# Altium schematic sheet Sheet1.SchDoc
size A4; SheetNumber: 1; SheetTotal: 1
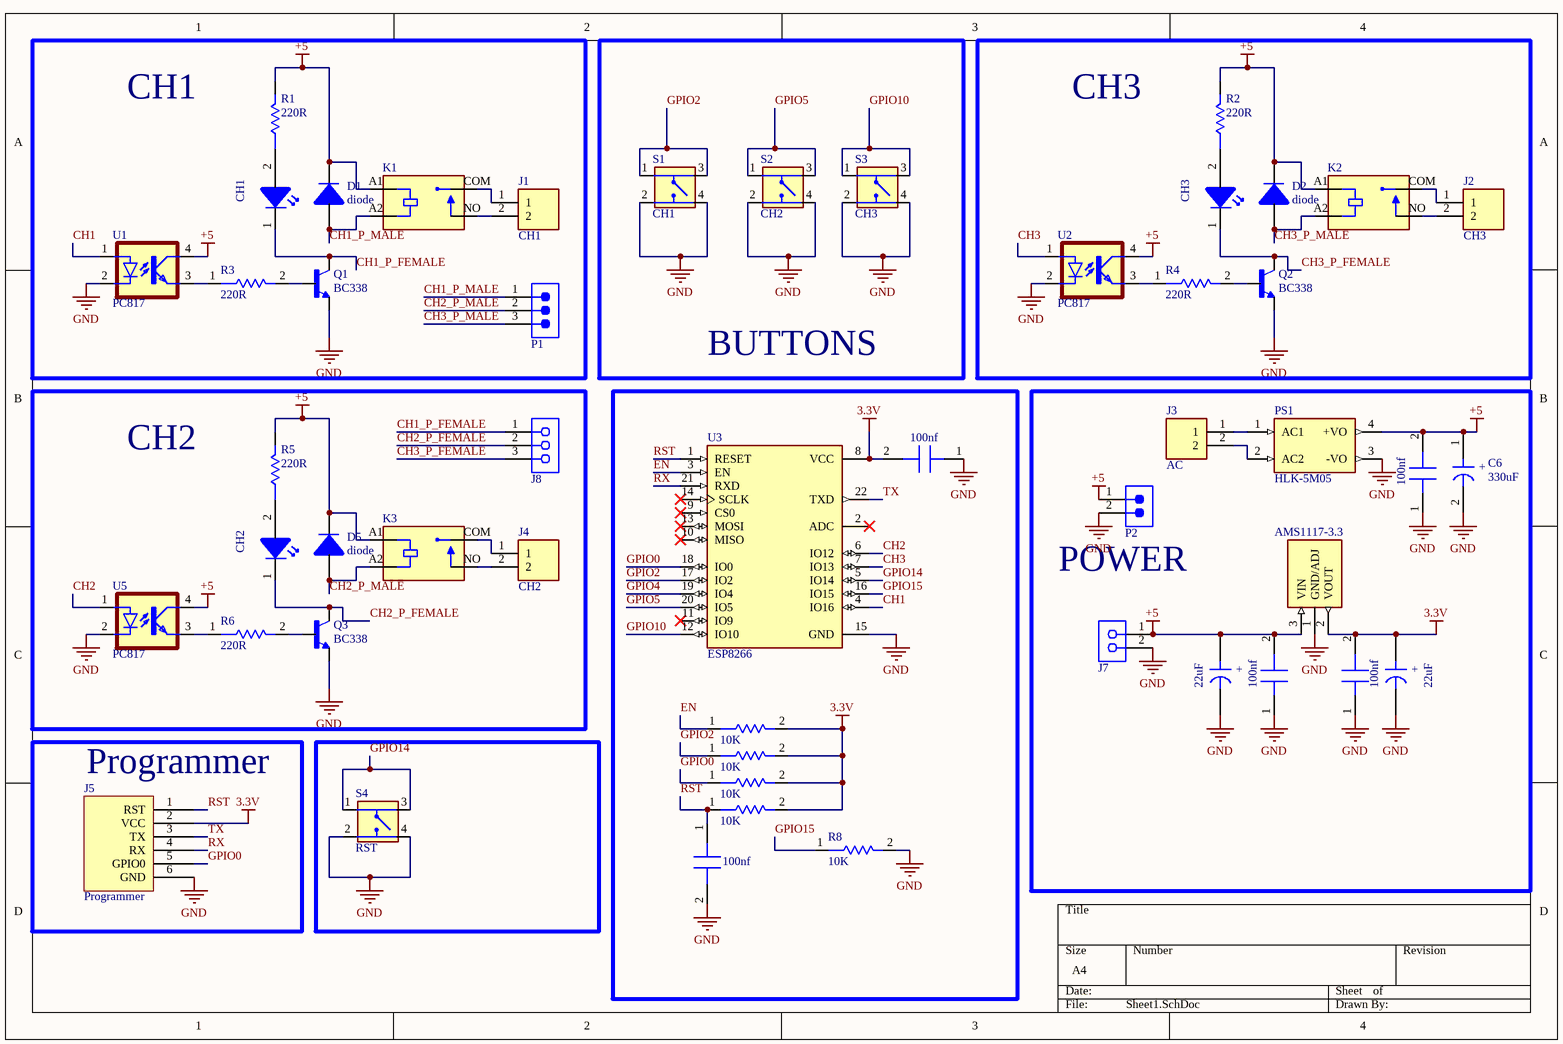
[diagram p0: Sheet1.SchDoc]

## Parts
C1  100nf  [CL31B104KCFNNNE]
C4  100nf  [CL31B104KCFNNNE]
C5  100nf  [CL31B104KCFNNNE]
C6  330uF  [UCL1V331MNL1GS]
C7  100nf  [CL31B104KCFNNNE]
C8  100nf  [CL31B104KCFNNNE]
C9  22uF  [865060342002]
C10  22uF  [865060342002]
D1  diode  [1N4007W]
D2  diode  [1N4007W]
D3  CH1  [IN-S126ATR]
D4  CH3  [IN-S126ATR]
D5  diode  [1N4007W]
D6  CH2  [IN-S126ATR]
J1  CH1  [KF127-5.0-2P]
J2  CH3  [KF127-5.0-2P]
J3  AC  [KF127-5.0-2P]
J4  CH2  [KF127-5.0-2P]
J5  Programmer  [PHT-106-XX-X-S]
J7  61300211821  [61300211821]  (value not drawn)
J8  61300311821  [61300311821]  (value not drawn)
K1  PR8-5V-450-1A  [PR8-5V-450-1A]  (value not drawn)
K2  PR8-5V-450-1A  [PR8-5V-450-1A]  (value not drawn)
K3  PR8-5V-450-1A  [PR8-5V-450-1A]  (value not drawn)
P1  61300311121  [61300311121]  (value not drawn)
P2  61300211121  [61300211121]  (value not drawn)
PS1  HLK-5M05  [HLK-5M05]
Q1  BC338  [BC338]
Q2  BC338  [BC338]
Q3  BC338  [BC338]
R1  220R  [RMCF1206FT220R]
R2  220R  [RMCF1206FT220R]
R3  220R  [RMCF1206FT220R]
R4  220R  [RMCF1206FT220R]
R5  220R  [RMCF1206FT220R]
R6  220R  [RMCF1206FT220R]
R7  10K  [RC1206FR-0710KL]
R8  10K  [RC1206FR-0710KL]
R9  10K  [RC1206FR-0710KL]
R11  10K  [RC1206FR-0710KL]
R12  10K  [RC1206FR-0710KL]
S1  CH1  [FSM8JH]
S2  CH2  [FSM8JH]
S3  CH3  [FSM8JH]
S4  RST  [FSM8JH]
U1  PC817  [PC817X2NSZ9F]
U2  PC817  [PC817X2NSZ9F]
U3  ESP8266  [ESP8266-12-F]
U4  AMS1117-3.3  [AMS1117-3.3]
U5  PC817  [PC817X2NSZ9F]

## Blocks framed on the sheet
CH1: D1 D3 J1 K1 P1 Q1 R1 R3 U1
BUTTONS: S1-S3
CH3: D2 D4 J2 K2 Q2 R2 R4 U2
CH2: D5 D6 J4 J8 K3 Q3 R5 R6 U5
POWER: C5-C10 J3 J7 P2 PS1 U4
Programmer: J5

## Nets
3.3V: C4.2 C8.2 C10.1 J5.2(VCC) R7.2 R9.2 R11.2 R12.2 U3.8(VCC) U4.2(VOUT)
+5: C5.2 C6.1 C7.2 C9.1 D1.1 D2.1 D5.1 J7.1 K1.A1(COIL1) K2.A1(COIL1) K3.A1(COIL1) P2.1 PS1.4(+VO) R1.2 R2.2 R5.2 U1.4(COL) U2.4(COL) U4.3(VIN) U5.4(COL)
GND: C1.2 C4.1 C5.1 C6.2 C7.1 C8.1 C9.2 C10.2 J5.6(GND) J7.2 P2.2 PS1.3(-VO) Q1.E Q2.E Q3.E R8.2 S1.2 S1.4 S2.2 S2.4 S3.2 S3.4 S4.2 S4.4 U1.2(C) U2.2(C) U3.15(GND) U4.1(GND/ADJ) U5.2(C)
CH1: U1.1(A) U3.4(IO16)
CH1_P_FEMALE: D3.1 J8.1 Q1.C
CH1_P_MALE: D1.2 K1.A2(COIL2) P1.1
CH2: U3.6(IO12) U5.1(A)
CH2_P_FEMALE: D6.1 J8.2 Q3.C
CH2_P_MALE: D5.2 K3.A2(COIL2) P1.2
CH3: U2.1(A) U3.7(IO13)
CH3_P_FEMALE: D4.1 J8.3 Q2.C
CH3_P_MALE: D2.2 K2.A2(COIL2) P1.3
EN: R7.1 U3.3(EN)
GPIO0: J5.5(GPIO0) R9.1 U3.18(IO0)
GPIO2: R11.1 S1.1 S1.3 U3.17(IO2)
GPIO4: U3.19(IO4)
GPIO5: S2.1 S2.3 U3.20(IO5)
GPIO10: S3.1 S3.3 U3.12(IO10)
GPIO14: S4.1 S4.3 U3.5(IO14)
GPIO15: R8.1 U3.16(IO15)
RST: C1.1 J5.1(RST) R12.1 U3.1(RESET)
RX: J5.4(RX) U3.21(RXD)
TX: J5.3(TX) U3.22(TXD)
NetD3_2: D3.2 R1.1
NetD4_2: D4.2 R2.1
NetD6_2: D6.2 R5.1
NetJ1_1: J1.1 K1.COM
NetJ1_2: J1.2 K1.NO
NetJ2_1: J2.1 K2.COM
NetJ2_2: J2.2 K2.NO
NetJ3_1: J3.1 PS1.1(AC1)
NetJ3_2: J3.2 PS1.2(AC2)
NetJ4_1: J4.1 K3.COM
NetJ4_2: J4.2 K3.NO
NetQ1_B: Q1.B R3.2
NetQ2_B: Q2.B R4.2
NetQ3_B: Q3.B R6.2
NetR3_1: R3.1 U1.3(EMIT)
NetR4_1: R4.1 U2.3(EMIT)
NetR6_1: R6.1 U5.3(EMIT)

Not connected (* = marked no-connect by the designer): U3 2(ADC)* 9(CS0)* 10(MISO)* 11(IO9)* 13(MOSI)* 14(SCLK)*

## Notes on the sheet
- (in symbol 865060342002) +
- (in symbol UCL1V331MNL1GS) +

## Library data of the parts
C1 C4 C5 C7 C8 = CL31B104KCFNNNE: 0.1 µF ±10% 100V Ceramic Capacitor X7R 1206 (3216 Metric); P/N: 1276-1151-6-ND; ComponentLink1Description: Link; ComponentLink1URL: https://www.digikey.com/en/products/detail/samsung-electro-mechanics/CL31B104KCFNNNE/3886809
C6 = UCL1V331MNL1GS: 330 µF 35 V Aluminum Electrolytic Capacitors Radial, Can - SMD 2000 Hrs @ 105°C; P/N: 493-3959-6-ND; ComponentLink1Description: Link; ComponentLink1URL: https://www.digikey.com/en/products/detail/nichicon/UCL1V331MNL1GS/2300308
C9 C10 = 865060342002: 22 µF 16 V Aluminum Electrolytic Capacitors Radial, Can - SMD 2000 Hrs @ 105°C; P/N: 732-8519-6-ND; ComponentLink1Description: Link; ComponentLink1URL: https://www.digikey.com/en/products/detail/w%C3%BCrth-elektronik/865060342002/5728114
D1 D2 D5 = 1N4007W: Diode 1000 V 1A Surface Mount SOD-123FL; P/N: 5272-1N4007WDKR-ND; ComponentLink1Description: Link; ComponentLink1URL: https://www.digikey.com/en/products/detail/evvo/1N4007W/21407138
D3 D4 D6 = IN-S126ATR: Red 622nm LED Indication - Discrete 2V 1206 (3216 Metric); ComponentLink1Description: Link; ComponentLink1URL: https://makerselectronics.com/product/smd-led-red-1206
J1-J4 = KF127-5.0-2P: Connector, Terminal Block; Wire Receptacle; 2 Pos.; 16-30 AWG; 0.197 in. CL; Sid; ComponentLink1Description: Link; ComponentLink1URL: https://makerselectronics.com/product/kf127-5-0-2p-green-terminal-block
J5 = PHT-106-XX-X-S: 6 pin male pin header
J7 = 61300211821: WR-PHD Socket Header, THT, Vertical, pitch 2.54mm, 1 Row, 2P; Manufacturer: Wurth Elektronik; Contact Resistance: 20mOhm; Rated Current: 3A; Working Voltage: 250V; Withstanding Voltage: 500V; Manufacturer Part Number: 61300211821; Category: Board-to-Board Connectors; Match Code: WR-PHD; ComponentLink1Description: Website Link; ComponentLink1URL: https://www.we-online.com/redexpert/article/61300211821?ad; ComponentLink2Description: Datasheet Link; ComponentLink2URL: https://www.we-online.com/redexpert/spec/61300211821?ad; Mount: Through Hole; Operating Temperature Max: 125°C; Operating Temperature Min: -40°C; Packaging: Tray; Gender: Socket Header; Number of Pins: 2; Number of Rows: 1; Orientation: Vertical; Pitch: 2.54mm
J8 = 61300311821: WR-PHD Socket Header, THT, Vertical, pitch 2.54mm, 1 Row, 3P; Manufacturer: Wurth Elektronik; Contact Resistance: 20mOhm; Rated Current: 3A; Working Voltage: 250V; Withstanding Voltage: 500V; Manufacturer Part Number: 61300311821; Category: Board-to-Board Connectors; Match Code: WR-PHD; ComponentLink1Description: Website Link; ComponentLink1URL: https://www.we-online.com/redexpert/article/61300311821?ad; ComponentLink2Description: Datasheet Link; ComponentLink2URL: https://www.we-online.com/redexpert/spec/61300311821?ad; Mount: Through Hole; Operating Temperature Max: 125°C; Operating Temperature Min: -40°C; Packaging: Tray; Gender: Socket Header; Number of Pins: 3; Number of Rows: 1; Orientation: Vertical; Pitch: 2.54mm
K1-K3 = PR8-5V-450-1A: 18.2 x 10.2 x 15.5 mm, 5 V, 16 A, SPST (1 Form A), Power Relay; ComponentLink1Description: Makers Link; ComponentLink1URL: https://makerselectronics.com/product/fanhar-relay-fh17-1a2tle
P1 = 61300311121: WR-PHD Pin Header, THT, Vertical, pitch 2.54mm, 1 Row, 3P; Manufacturer: Wurth Elektronik; Contact Resistance: 20mOhm; Rated Current: 3A; Working Voltage: 250V; Withstanding Voltage: 500V; Manufacturer Part Number: 61300311121; Category: Board-to-Board Connectors; Match Code: WR-PHD; ComponentLink1Description: Website Link; ComponentLink1URL: https://www.we-online.com/redexpert/article/61300311121?ad; ComponentLink2Description: Datasheet Link; ComponentLink2URL: https://www.we-online.com/redexpert/spec/61300311121?ad; Mount: Through Hole; Operating Temperature Max: 105°C; Operating Temperature Min: -40°C; Packaging: Bag; Gender: Pin Header; Number of Pins: 3; Number of Rows: 1; Orientation: Vertical; Pitch: 2.54mm
P2 = 61300211121: WR-PHD Pin Header, THT, Vertical, pitch 2.54mm, 1 Row, 2P; Manufacturer: Wurth Elektronik; Contact Resistance: 20mOhm; Rated Current: 3A; Working Voltage: 250V; Withstanding Voltage: 500V; Manufacturer Part Number: 61300211121; Category: Board-to-Board Connectors; Match Code: WR-PHD; ComponentLink1Description: Website Link; ComponentLink1URL: https://www.we-online.com/redexpert/article/61300211121?ad; ComponentLink2Description: Datasheet Link; ComponentLink2URL: https://www.we-online.com/redexpert/spec/61300211121?ad; Mount: Through Hole; Operating Temperature Max: 105°C; Operating Temperature Min: -40°C; Packaging: Bag; Gender: Pin Header; Number of Pins: 2; Number of Rows: 1; Orientation: Vertical; Pitch: 2.54mm
PS1 = HLK-5M05: AC DC 220V to 5V 5W 5Watt Isolated Switching Step-Down Power Supply Module Converter; ComponentLink1Description: Link; ComponentLink1URL: https://makerselectronics.com/product/hlk-5m05-ac-dc-power-module
Q1-Q3 = BC338: Bipolar (BJT) Transistor NPN 25 V 800 mA 100MHz 625 mW Through Hole TO-92-3; P/N: BC338-ND; ComponentLink1Description: Link; ComponentLink1URL: https://www.digikey.com/en/products/detail/onsemi/BC338/978413
R1-R6 = RMCF1206FT220R: 220 Ohms ±1% 0.25W, 1/4W Chip Resistor 1206 (3216 Metric) Automotive AEC-Q200 Thick Film; P/N: RMCF1206FT220RDKR-ND; ComponentLink1Description: link; ComponentLink1URL: https://www.digikey.com/en/products/detail/stackpole-electronics-inc/RMCF1206FT220R/1759830
R7-R9 R11 R12 = RC1206FR-0710KL: 10 kOhms ±1% 0.25W, 1/4W Chip Resistor 1206 (3216 Metric) Moisture Resistant Thick Film; P/N: 311-10.0KFRDKR-ND; ComponentLink1Description: Digikey link; ComponentLink1URL: https://www.digikey.com/en/products/detail/yageo/RC1206FR-0710KL/728483; ComponentLink2Description: Makers link; ComponentLink2URL: https://makerselectronics.com/product/chip-resistor-smd-10k%cf%89-%c2%b11-250mw-1206
S1-S4 = FSM8JH: Tactile Switch SPST-NO Top Actuated Through Hole; ComponentLink1Description: Link; ComponentLink1URL: https://makerselectronics.com/product/mini-push-button-switch-4-pin-6x6x5mm
U1 U2 U5 = PC817X2NSZ9F: Optoisolator Transistor Output 5000Vrms 1 Channel 4-DIP; P/N: PC817X2NSZ9F-ND; ComponentLink1Description: Link; ComponentLink1URL: https://www.digikey.com/en/products/detail/sharp-socle-technology/PC817X2NSZ9F/7942022
U3 = ESP8266-12-F: This WiFi module has a 32-bit MCU micro and clock speeds supporting 80 MHz or 160 MHz. Supports the RTOS and integrated Wi-Fi MAC/BB/RF/PA/LNA, and has an on-board antenna.; ComponentLink1Description: Link; ComponentLink1URL: https://makerselectronics.com/product/wifi-esp8266-12-f-module
U4 = AMS1117-3.3: Sot223/Pkg 1-Amp 3.3-Volt Low Drop Out Voltage Regulatator; ComponentLink1Description: Link; ComponentLink1URL: https://makerselectronics.com/product/ams1117-3-3v-smd-fixed-12v-3-3v-800ma-sot-223-dropout-regulators